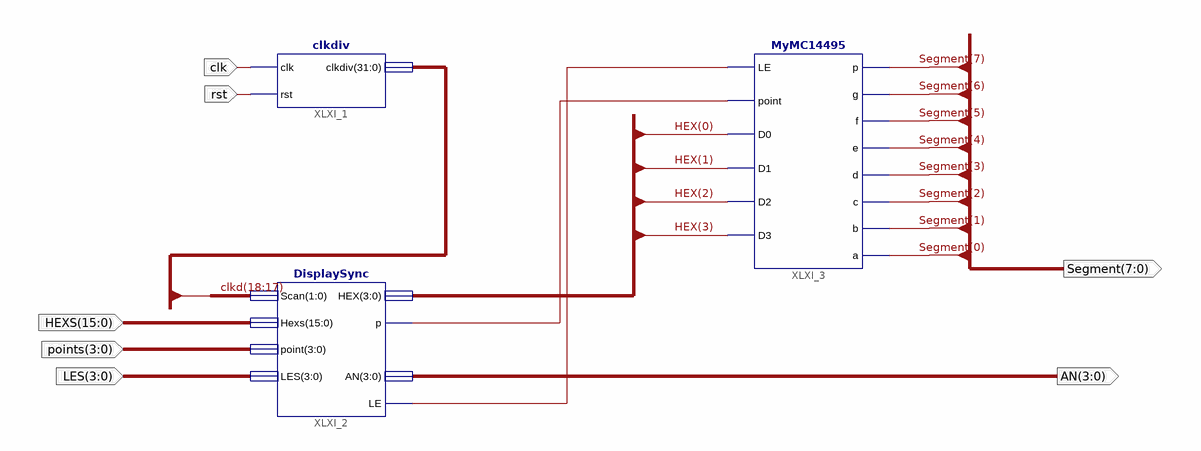
[diagram p0: schematic sheet 1]
// Xilinx ISE schematic disp_num.sch (kintex7) as structural Verilog: 3 symbols, 7 ports
module disp_num (
  input  [15:0] HEXS,
  input  [3:0] points,
  input  [3:0] LES,
  input  clk,
  input  rst,
  output [3:0] AN,
  output [7:0] Segment
);

  wire XLXN_15, XLXN_16;
  wire [3:0] HEX;
  wire [31:0] clkd;

  clkdiv XLXI_1 (.clk(clk), .rst(rst), .clkdiv(clkd));
  DisplaySync XLXI_2 (
    .Scan(clkd[18:17]), .Hexs(HEXS), .point(points), .LES(LES), .HEX(HEX), .p(XLXN_16), .AN(AN), .LE(XLXN_15));
  MyMC14495 XLXI_3 (
    .LE(XLXN_15), .point(XLXN_16), .D0(HEX[0]), .D1(HEX[1]), .D2(HEX[2]), .D3(HEX[3]), .p(Segment[7]),
    .g(Segment[6]), .f(Segment[5]), .e(Segment[4]), .d(Segment[3]), .c(Segment[2]), .b(Segment[1]),
    .a(Segment[0]));
endmodule
